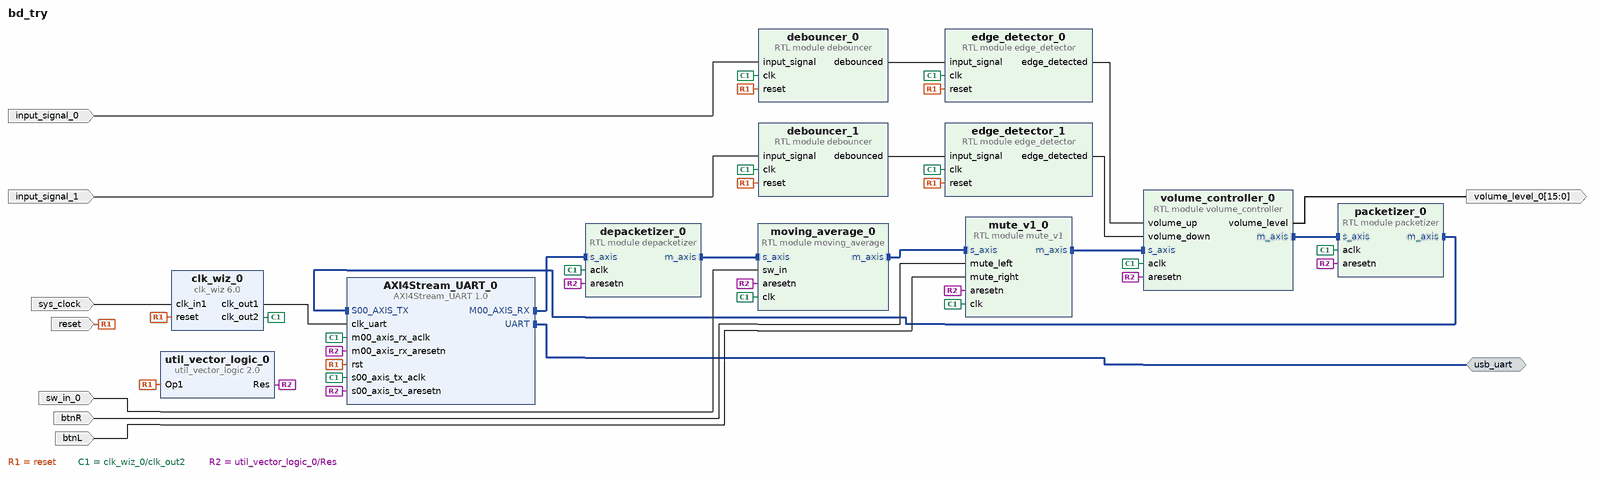
[diagram p0: block diagram of the top level]
# Vivado block design bd_try, xc7a35tcpg236-1, Vivado 2019.2
create_bd_design bd_try

create_bd_intf_port -mode Master -vlnv xilinx.com:interface:uart_rtl:1.0 usb_uart
create_bd_port -dir I -type clk sys_clock
set_property -dict {CONFIG.FREQ_HZ 100000000 CONFIG.PHASE 0.000} [get_bd_ports sys_clock]
create_bd_port -dir I -type rst reset
set_property -dict {CONFIG.POLARITY ACTIVE_HIGH} [get_bd_ports reset]
create_bd_port -dir O -from 15 -to 0 volume_level_0
create_bd_port -dir I input_signal_0
create_bd_port -dir I input_signal_1
create_bd_port -dir I sw_in_0
create_bd_port -dir I btnR
create_bd_port -dir I btnL

create_bd_cell -type ip -vlnv TimeEngineers:ip:AXI4Stream_UART:1.0 AXI4Stream_UART_0
set_property -dict [list \
  CONFIG.UART_BAUD_RATE 2000000 \
  CONFIG.UART_BOARD_INTERFACE usb_uart \
  CONFIG.USE_BOARD_FLOW true \
] [get_bd_cells AXI4Stream_UART_0]
create_bd_cell -type ip -vlnv xilinx.com:ip:util_vector_logic:2.0 util_vector_logic_0
set_property -dict {CONFIG.C_OPERATION not} [get_bd_cells util_vector_logic_0]
create_bd_cell -type ip -vlnv xilinx.com:ip:clk_wiz:6.0 clk_wiz_0
set_property -dict [list \
  CONFIG.CLKOUT1_JITTER 138.844 \
  CONFIG.CLKOUT1_PHASE_ERROR 105.461 \
  CONFIG.CLKOUT1_REQUESTED_OUT_FREQ 96.000 \
  CONFIG.CLKOUT2_JITTER 117.993 \
  CONFIG.CLKOUT2_PHASE_ERROR 105.461 \
  CONFIG.CLKOUT2_REQUESTED_OUT_FREQ 225.000 \
  CONFIG.CLKOUT2_USED true \
  CONFIG.CLK_IN1_BOARD_INTERFACE sys_clock \
  CONFIG.MMCM_CLKFBOUT_MULT_F 9.000 \
  CONFIG.MMCM_CLKIN1_PERIOD 10.000 \
  CONFIG.MMCM_CLKIN2_PERIOD 10.000 \
  CONFIG.MMCM_CLKOUT0_DIVIDE_F 9.375 \
  CONFIG.MMCM_CLKOUT1_DIVIDE 4 \
  CONFIG.MMCM_DIVCLK_DIVIDE 1 \
  CONFIG.NUM_OUT_CLKS 2 \
  CONFIG.RESET_BOARD_INTERFACE reset \
  CONFIG.USE_BOARD_FLOW true \
] [get_bd_cells clk_wiz_0]
create_bd_cell -type module -reference depacketizer depacketizer_0
create_bd_cell -type module -reference packetizer packetizer_0
create_bd_cell -type module -reference debouncer debouncer_0
create_bd_cell -type module -reference debouncer debouncer_1
create_bd_cell -type module -reference edge_detector edge_detector_0
create_bd_cell -type module -reference edge_detector edge_detector_1
create_bd_cell -type module -reference mute_v1 mute_v1_0
create_bd_cell -type module -reference volume_controller volume_controller_0
create_bd_cell -type module -reference moving_average moving_average_0

# ---- connections ----

connect_bd_intf_net [get_bd_intf_ports usb_uart] [get_bd_intf_pins AXI4Stream_UART_0/UART]
connect_bd_intf_net [get_bd_intf_pins AXI4Stream_UART_0/M00_AXIS_RX] [get_bd_intf_pins depacketizer_0/s_axis]
connect_bd_intf_net [get_bd_intf_pins depacketizer_0/m_axis] [get_bd_intf_pins moving_average_0/s_axis]
connect_bd_intf_net [get_bd_intf_pins volume_controller_0/m_axis] [get_bd_intf_pins packetizer_0/s_axis]
connect_bd_intf_net [get_bd_intf_pins moving_average_0/m_axis] [get_bd_intf_pins mute_v1_0/s_axis]
connect_bd_intf_net [get_bd_intf_pins packetizer_0/m_axis] [get_bd_intf_pins AXI4Stream_UART_0/S00_AXIS_TX]
connect_bd_intf_net [get_bd_intf_pins mute_v1_0/m_axis] [get_bd_intf_pins volume_controller_0/s_axis]
connect_bd_net [get_bd_ports sys_clock] [get_bd_pins clk_wiz_0/clk_in1]
connect_bd_net [get_bd_ports reset] \
  [get_bd_pins clk_wiz_0/reset] [get_bd_pins util_vector_logic_0/Op1] [get_bd_pins AXI4Stream_UART_0/rst] \
  [get_bd_pins edge_detector_0/reset] [get_bd_pins debouncer_1/reset] [get_bd_pins edge_detector_1/reset] \
  [get_bd_pins debouncer_0/reset]
connect_bd_net [get_bd_pins clk_wiz_0/clk_out1] [get_bd_pins AXI4Stream_UART_0/clk_uart]
connect_bd_net [get_bd_pins clk_wiz_0/clk_out2] \
  [get_bd_pins AXI4Stream_UART_0/m00_axis_rx_aclk] [get_bd_pins AXI4Stream_UART_0/s00_axis_tx_aclk] \
  [get_bd_pins depacketizer_0/aclk] [get_bd_pins packetizer_0/aclk] [get_bd_pins edge_detector_0/clk] \
  [get_bd_pins debouncer_1/clk] [get_bd_pins edge_detector_1/clk] [get_bd_pins debouncer_0/clk] [get_bd_pins mute_v1_0/clk] \
  [get_bd_pins volume_controller_0/aclk] [get_bd_pins moving_average_0/clk]
connect_bd_net [get_bd_pins util_vector_logic_0/Res] \
  [get_bd_pins AXI4Stream_UART_0/s00_axis_tx_aresetn] [get_bd_pins AXI4Stream_UART_0/m00_axis_rx_aresetn] \
  [get_bd_pins depacketizer_0/aresetn] [get_bd_pins packetizer_0/aresetn] [get_bd_pins mute_v1_0/aresetn] \
  [get_bd_pins volume_controller_0/aresetn] [get_bd_pins moving_average_0/aresetn]
connect_bd_net [get_bd_pins debouncer_0/debounced] [get_bd_pins edge_detector_0/input_signal]
connect_bd_net [get_bd_pins edge_detector_0/edge_detected] [get_bd_pins volume_controller_0/volume_up]
connect_bd_net [get_bd_pins debouncer_1/debounced] [get_bd_pins edge_detector_1/input_signal]
connect_bd_net [get_bd_pins edge_detector_1/edge_detected] [get_bd_pins volume_controller_0/volume_down]
connect_bd_net [get_bd_pins volume_controller_0/volume_level] [get_bd_ports volume_level_0]
connect_bd_net -net input_signal_0_1 [get_bd_ports input_signal_0] [get_bd_pins debouncer_0/input_signal]
connect_bd_net -net input_signal_1_1 [get_bd_ports input_signal_1] [get_bd_pins debouncer_1/input_signal]
connect_bd_net -net sw_in_0_1 [get_bd_ports sw_in_0] [get_bd_pins moving_average_0/sw_in]
connect_bd_net -net mute_left_0_1 [get_bd_ports btnR] [get_bd_pins mute_v1_0/mute_left]
connect_bd_net -net mute_right_0_1 [get_bd_ports btnL] [get_bd_pins mute_v1_0/mute_right]

validate_bd_design
save_bd_design
